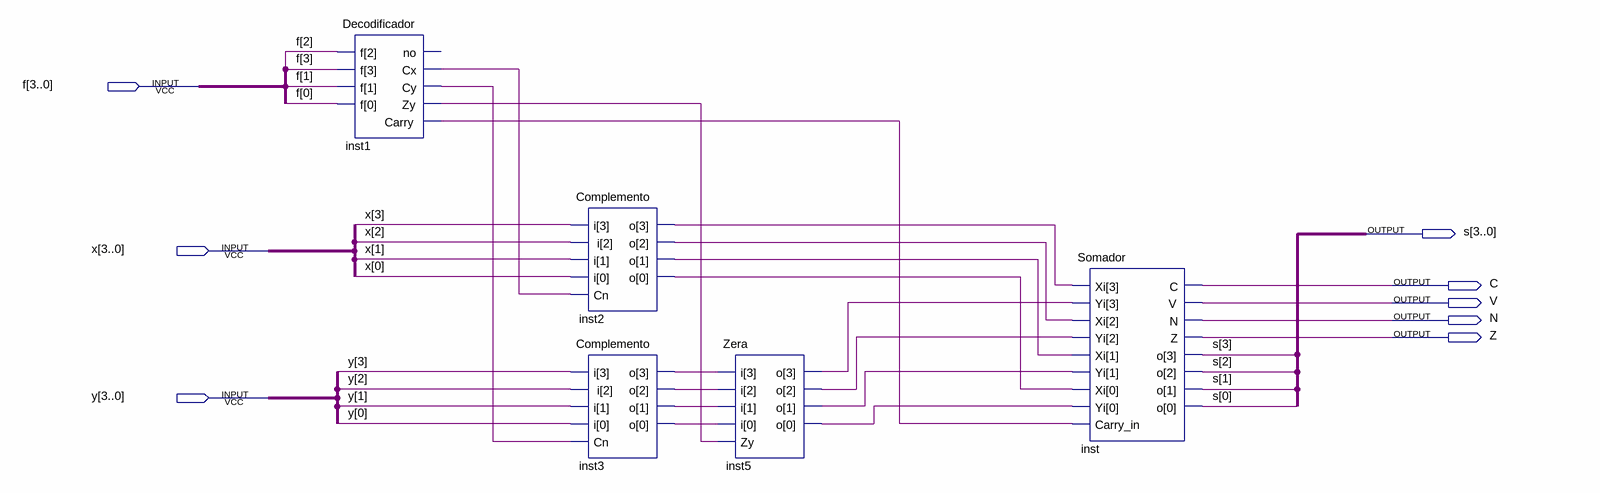
[diagram p0: schematic sheet]
// Quartus schematic ULA.bdf as structural Verilog: 5 symbols, 8 pins
module ULA (
  input  [3:0] f,
  input  [3:0] x,
  input  [3:0] y,
  output [3:0] s,
  output C,
  output V,
  output N,
  output Z
);

  wire inst1_carry, inst1_cx, inst1_cy, inst1_zy, inst2_o, inst2_o_2, inst2_o_3, inst2_o_4, inst3_o,
       inst3_o_2, inst3_o_3, inst3_o_4, inst5_o, inst5_o_2, inst5_o_3, inst5_o_4;

  Decodificador inst1 (.f(f), .Cx(inst1_cx), .Cy(inst1_cy), .Zy(inst1_zy), .Carry(inst1_carry));  // open: no
  Complemento inst2 (.i(x), .Cn(inst1_cx), .o({inst2_o, inst2_o_2, inst2_o_3, inst2_o_4}));
  Complemento inst3 (.i(y), .Cn(inst1_cy), .o({inst3_o, inst3_o_2, inst3_o_3, inst3_o_4}));
  Zera inst5 (
    .i({inst3_o, inst3_o_2, inst3_o_3, inst3_o_4}), .Zy(inst1_zy),
    .o({inst5_o_4, inst5_o_3, inst5_o_2, inst5_o}));
  Somador inst (
    .Xi({inst2_o, inst2_o_2, inst2_o_3, inst2_o_4}), .Yi({inst5_o_4, inst5_o_3, inst5_o_2, inst5_o}),
    .Carry_in(inst1_carry), .C(C), .V(V), .N(N), .Z(Z), .o(s));
endmodule
